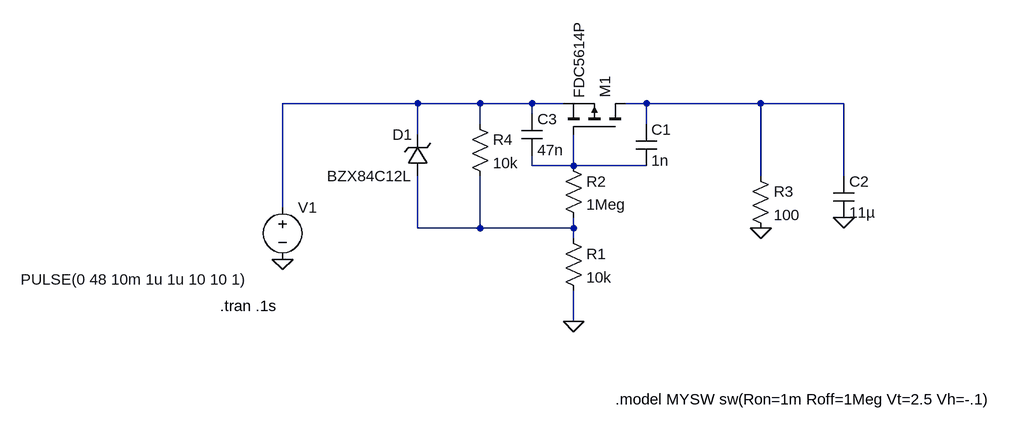
[diagram p0: schematic slow_rise_fet.asc]
slow_rise_fet.asc, the LTspice schematic file:
Version 4
SHEET 1 1000 680
WIRE 64 -32 -144 -32
WIRE 160 -32 64 -32
WIRE 240 -32 160 -32
WIRE 288 -32 240 -32
WIRE 416 -32 384 -32
WIRE 592 -32 416 -32
WIRE 720 -32 592 -32
WIRE 240 -16 240 -32
WIRE 160 0 160 -32
WIRE 416 0 416 -32
WIRE 64 16 64 -32
WIRE 240 64 240 48
WIRE 304 64 304 16
WIRE 304 64 240 64
WIRE 416 64 304 64
WIRE 592 80 592 -32
WIRE 720 80 720 -32
WIRE -144 128 -144 -32
WIRE 64 160 64 80
WIRE 160 160 160 80
WIRE 160 160 64 160
WIRE 304 160 304 144
WIRE 304 160 160 160
WIRE 304 176 304 160
WIRE 304 304 304 256
FLAG -144 208 0
FLAG 304 304 0
FLAG 592 160 0
FLAG 720 144 0
SYMBOL voltage -144 112 R0
WINDOW 3 -403 127 Left 2
WINDOW 123 0 0 Left 0
WINDOW 39 0 0 Left 0
SYMATTR Value PULSE(0 48 10m 1u 1u 10 10 1)
SYMATTR InstName V1
SYMBOL res 288 160 R0
SYMATTR InstName R1
SYMATTR Value 10k
SYMBOL res 576 64 R0
SYMATTR InstName R3
SYMATTR Value 100
SYMBOL cap 704 80 R0
SYMATTR InstName C2
SYMATTR Value 11µ
SYMATTR SpiceLine Rser=.02
SYMBOL pmos 384 16 M270
SYMATTR InstName M1
SYMATTR Value FDC5614P
SYMBOL zener 80 80 R180
WINDOW 0 24 64 Left 2
WINDOW 3 24 0 Left 2
SYMATTR InstName D1
SYMATTR Value BZX84C12L
SYMATTR Description Diode
SYMATTR Type diode
SYMBOL res 288 48 R0
SYMATTR InstName R2
SYMATTR Value 1Meg
SYMBOL res 144 -16 R0
SYMATTR InstName R4
SYMATTR Value 10k
SYMBOL cap 400 0 R0
SYMATTR InstName C1
SYMATTR Value 1n
SYMBOL cap 224 -16 R0
SYMATTR InstName C3
SYMATTR Value 47n
TEXT -240 280 Left 2 !.tran .1s
TEXT 368 424 Left 2 !.model MYSW sw(Ron=1m Roff=1Meg Vt=2.5 Vh=-.1)

The netlist it stands for:
* slow_rise_fet.asc
V1 N001 0 PULSE(0 48 10m 1u 1u 10 10 1)
R1 N004 0 10k
R3 N002 0 100
C2 N002 0 11µ Rser=.02
M1 N002 N003 N001 N001 FDC5614P
D1 N004 N001 BZX84C12L
R2 N003 N004 1Meg
R4 N001 N004 10k
C1 N002 N003 1n
C3 N001 N003 47n
.model D D
.lib standard.dio
.model NMOS NMOS
.model PMOS PMOS
.lib standard.mos
.tran .1s
.model MYSW sw(Ron=1m Roff=1Meg Vt=2.5 Vh=-.1)
.backanno
.end